# Altium schematic sheet Balance_batt_protection.SchDoc
size A; SheetNumber: 1; SheetTotal: 5
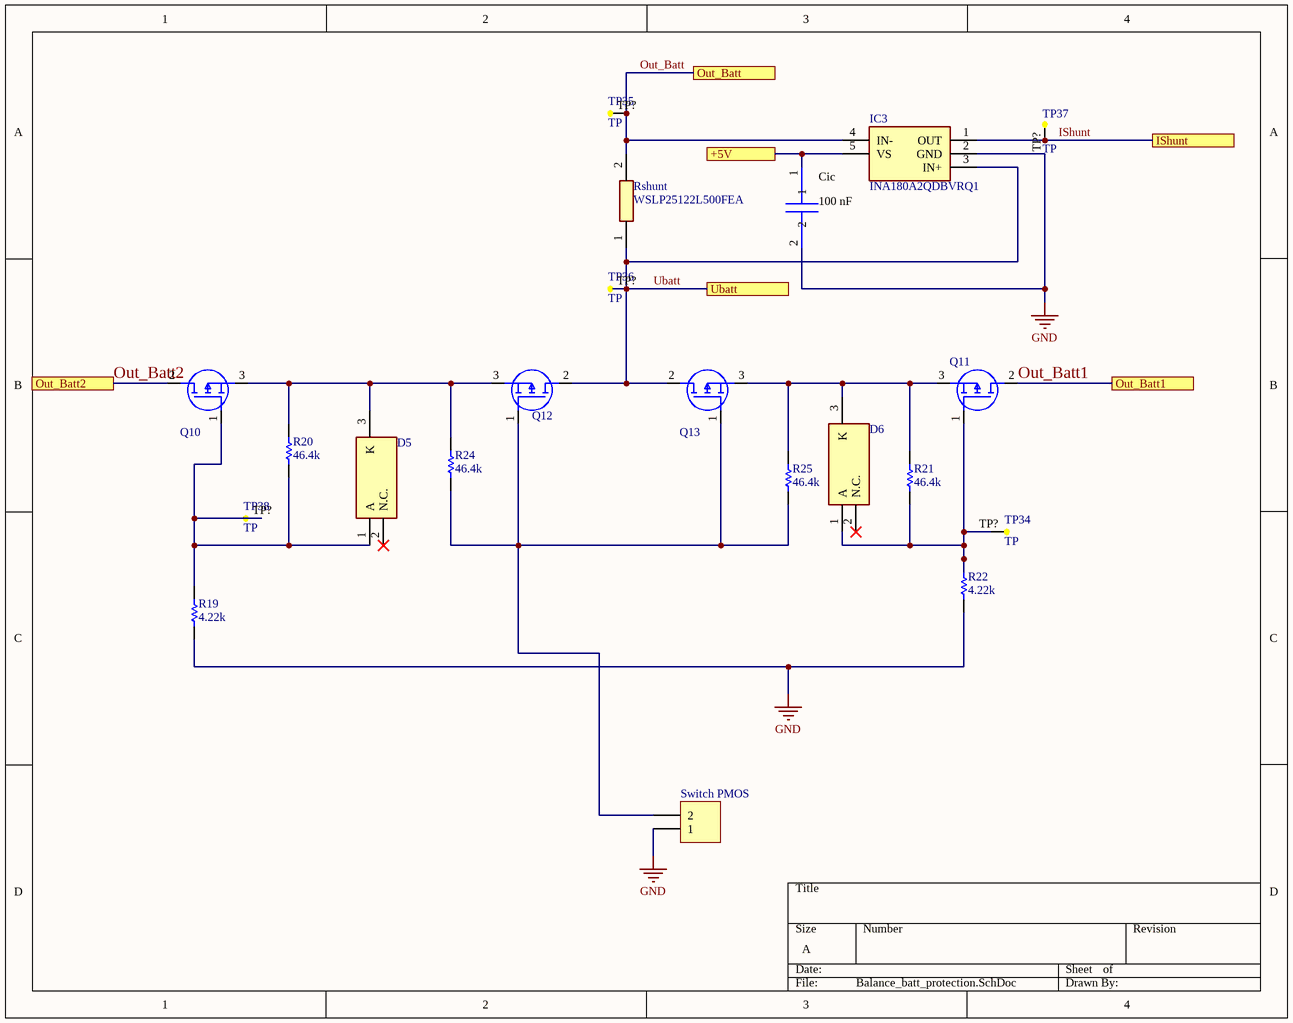
[diagram p0: Balance_batt_protection.SchDoc]

## Parts
Cic  value 100 nF  [CAPC1005X55N]  (hidden comment: C2012X7S1C106K)
D5  SZBZX84C18ET1G  [SOT95P230X110-3N]  (value not drawn)
D6  SZBZX84C18ET1G  [SOT95P230X110-3N]  (value not drawn)
IC3  INA180A2QDBVRQ1  [SOT95P280X145-5N]
Q10  SQD50P04-09L_GE3  [SQD50P0409L_GE3]  (value not drawn)
Q11  SQD50P04-09L_GE3  [SQD50P0409L_GE3]  (value not drawn)
Q12  SQD50P04-09L_GE3  [SQD50P0409L_GE3]  (value not drawn)
Q13  SQD50P04-09L_GE3  [SQD50P0409L_GE3]  (value not drawn)
R19  value 4.22k  [ERJP06D1000V]  (hidden comment: MCR03..PFX1002)
R20  value 46.4k  [RESC1608X55N]  (hidden comment: MCR03..PFX1002)
R21  value 46.4k  [RESC1608X55N]  (hidden comment: MCR03..PFX1002)
R22  value 4.22k  [ERJP06D1000V]  (hidden comment: MCR03..PFX1002)
R24  value 46.4k  [RESC1608X55N]  (hidden comment: MCR03..PFX1002)
R25  value 46.4k  [RESC1608X55N]  (hidden comment: MCR03..PFX1002)
Rshunt  WSLP25122L500FEA  [RESC6432X89N]
Switch_PMOS  5V  [TB002V50002BE]  (value not drawn)
TP34  TP  [Test_Point0.5x0.5]
TP35  TP  [Test_Point0.5x0.5]
TP36  TP  [Test_Point0.5x0.5]
TP37  TP  [Test_Point0.5x0.5]
TP38  TP  [Test_Point0.5x0.5]

## Ports
+5V, IShunt, Out_Batt, Out_Batt1, Out_Batt2, Ubatt

## Nets
GND: Cic.2 IC3.2(GND) R19.2 R22.2 Switch_PMOS.1
+5V: Cic.1 IC3.5(VS) ; port +5V
IShunt: IC3.1(OUT) TP37.TP?(TP) ; port IShunt
Out_Batt: IC3.4(IN-) Rshunt.2 TP35.TP?(TP) ; port Out_Batt
Out_Batt1: Q11.2(D) ; port Out_Batt1
Out_Batt2: Q10.2(D) ; port Out_Batt2
Ubatt: IC3.3(IN+) Q12.2(D) Q13.2(D) Rshunt.1 TP36.TP?(TP) ; port Ubatt
NetD5_1: D5.1(A) Q10.1(G) R19.1 R20.2 TP38.TP?(TP)
NetD5_3: D5.3(K) Q10.3(S) Q12.3(S) R20.1 R24.1
NetD6_1: D6.1(A) Q11.1(G) R21.2 R22.1 TP34.TP?(TP)
NetD6_3: D6.3(K) Q11.3(S) Q13.3(S) R21.1 R25.1
NetQ12_1: Q12.1(G) Q13.1(G) R24.2 R25.2 Switch_PMOS.2

Not connected (* = marked no-connect by the designer): D5 2(N.C.)*; D6 2(N.C.)*

## Library data of the parts
Cic = C3216X6S1V106K160AC: C3216X6S1V106K16; Manufacturer Name: TDK; PackageReference: C3216X6S1V106K160AC; Manufacturer Part Number: C3216X6S1V106K160AC
D5 D6 = BZX84W-C15F: Zener Diode; Manufacturer_Name: Nexperia; Datasheet Link: https://assets.nexperia.com/documents/data-sheet/BZX84W_SER.pdf; Height: 1.1mm; Manufacturer_Part_Number: BZX84W-C15F; Mouser Part Number: 771-BZX84W-C15F; Mouser Price/Stock: https://www.mouser.co.uk/ProductDetail/Nexperia/BZX84W-C15F?qs=MLItCLRbWsyz6DhKLlcnOA%3D%3D; Arrow Part Number: BZX84W-C15F; Arrow Price/Stock: https://www.arrow.com/en/products/bzx84w-c15f/nexperia
IC3 = INA180A2QDBVRQ1: Attenuator or Isolator; Manufacturer_Name: Texas Instruments; Datasheet Link: http://www.ti.com/lit/gpn/INA180-Q1; Height: 1.45mm; Manufacturer_Part_Number: INA180A2QDBVRQ1; Mouser Part Number: 595-INA180A2QDBVRQ1; Mouser Price/Stock: https://www.mouser.co.uk/ProductDetail/Texas-Instruments/INA180A2QDBVRQ1?qs=9r4v7xj2LnnPs8OEye75UA%3D%3D; Arrow Part Number: INA180A2QDBVRQ1; Arrow Price/Stock: https://www.arrow.com/en/products/ina180a2qdbvrq1/texas-instruments?region=nac
Q10-Q13 = SQD50P04-09L_GE3: MOSFET (P-Channel); Manufacturer_Name: Vishay; Datasheet Link: https://www.vishay.com/docs/65018/sqd50p04.pdf; Height: 2.28mm; Manufacturer_Part_Number: SQD50P04-09L_GE3; Mouser Part Number: 78-SQD50P04-09L_GE3; Mouser Price/Stock: https://www.mouser.co.uk/ProductDetail/Vishay-Siliconix/SQD50P04-09L_GE3?qs=jHkklCh7amiWGBpNycQWww%3D%3D
R19-R22 R24 R25 = Res1: Resistor; Published: 8-Jun-2000; LatestRevisionDate: 17-Jul-2002; LatestRevisionNote: Re-released for DXP Platform.; PackageReference: AXIAL-0.3; Publisher: Altium Limited; PackageDescription: Axial Device, Thru-Hole; 2 Leads; 0.3 in Pin Spacing
Rshunt = WSLP25122L500FEA: Resistor; Manufacturer_Name: Vishay; Datasheet Link: https://componentsearchengine.com/Datasheets/1/WSLP25122L500FEA.pdf; Height: 0.889mm; Manufacturer_Part_Number: WSLP25122L500FEA; Mouser Part Number: 71-WSLP25122L500FEA; Mouser Price/Stock: https://www.mouser.co.uk/ProductDetail/Vishay-Dale/WSLP25122L500FEA?qs=%2FCXICPRLKg%252BpcyljWM%2FHhA%3D%3D; Arrow Part Number: WSLP25122L500FEA; Arrow Price/Stock: https://www.arrow.com/en/products/wslp25122l500fea/vishay
Switch_PMOS = Header 2: Header, 2-Pin; LatestRevisionDate: 17-Jul-2002; LatestRevisionNote: Re-released for DXP Platform.; Publisher: Altium Limited
TP34-TP38 = TEst_Point_0.5x0.5